# EAGLE schematic fbri_development (EAGLE 6.6.0)
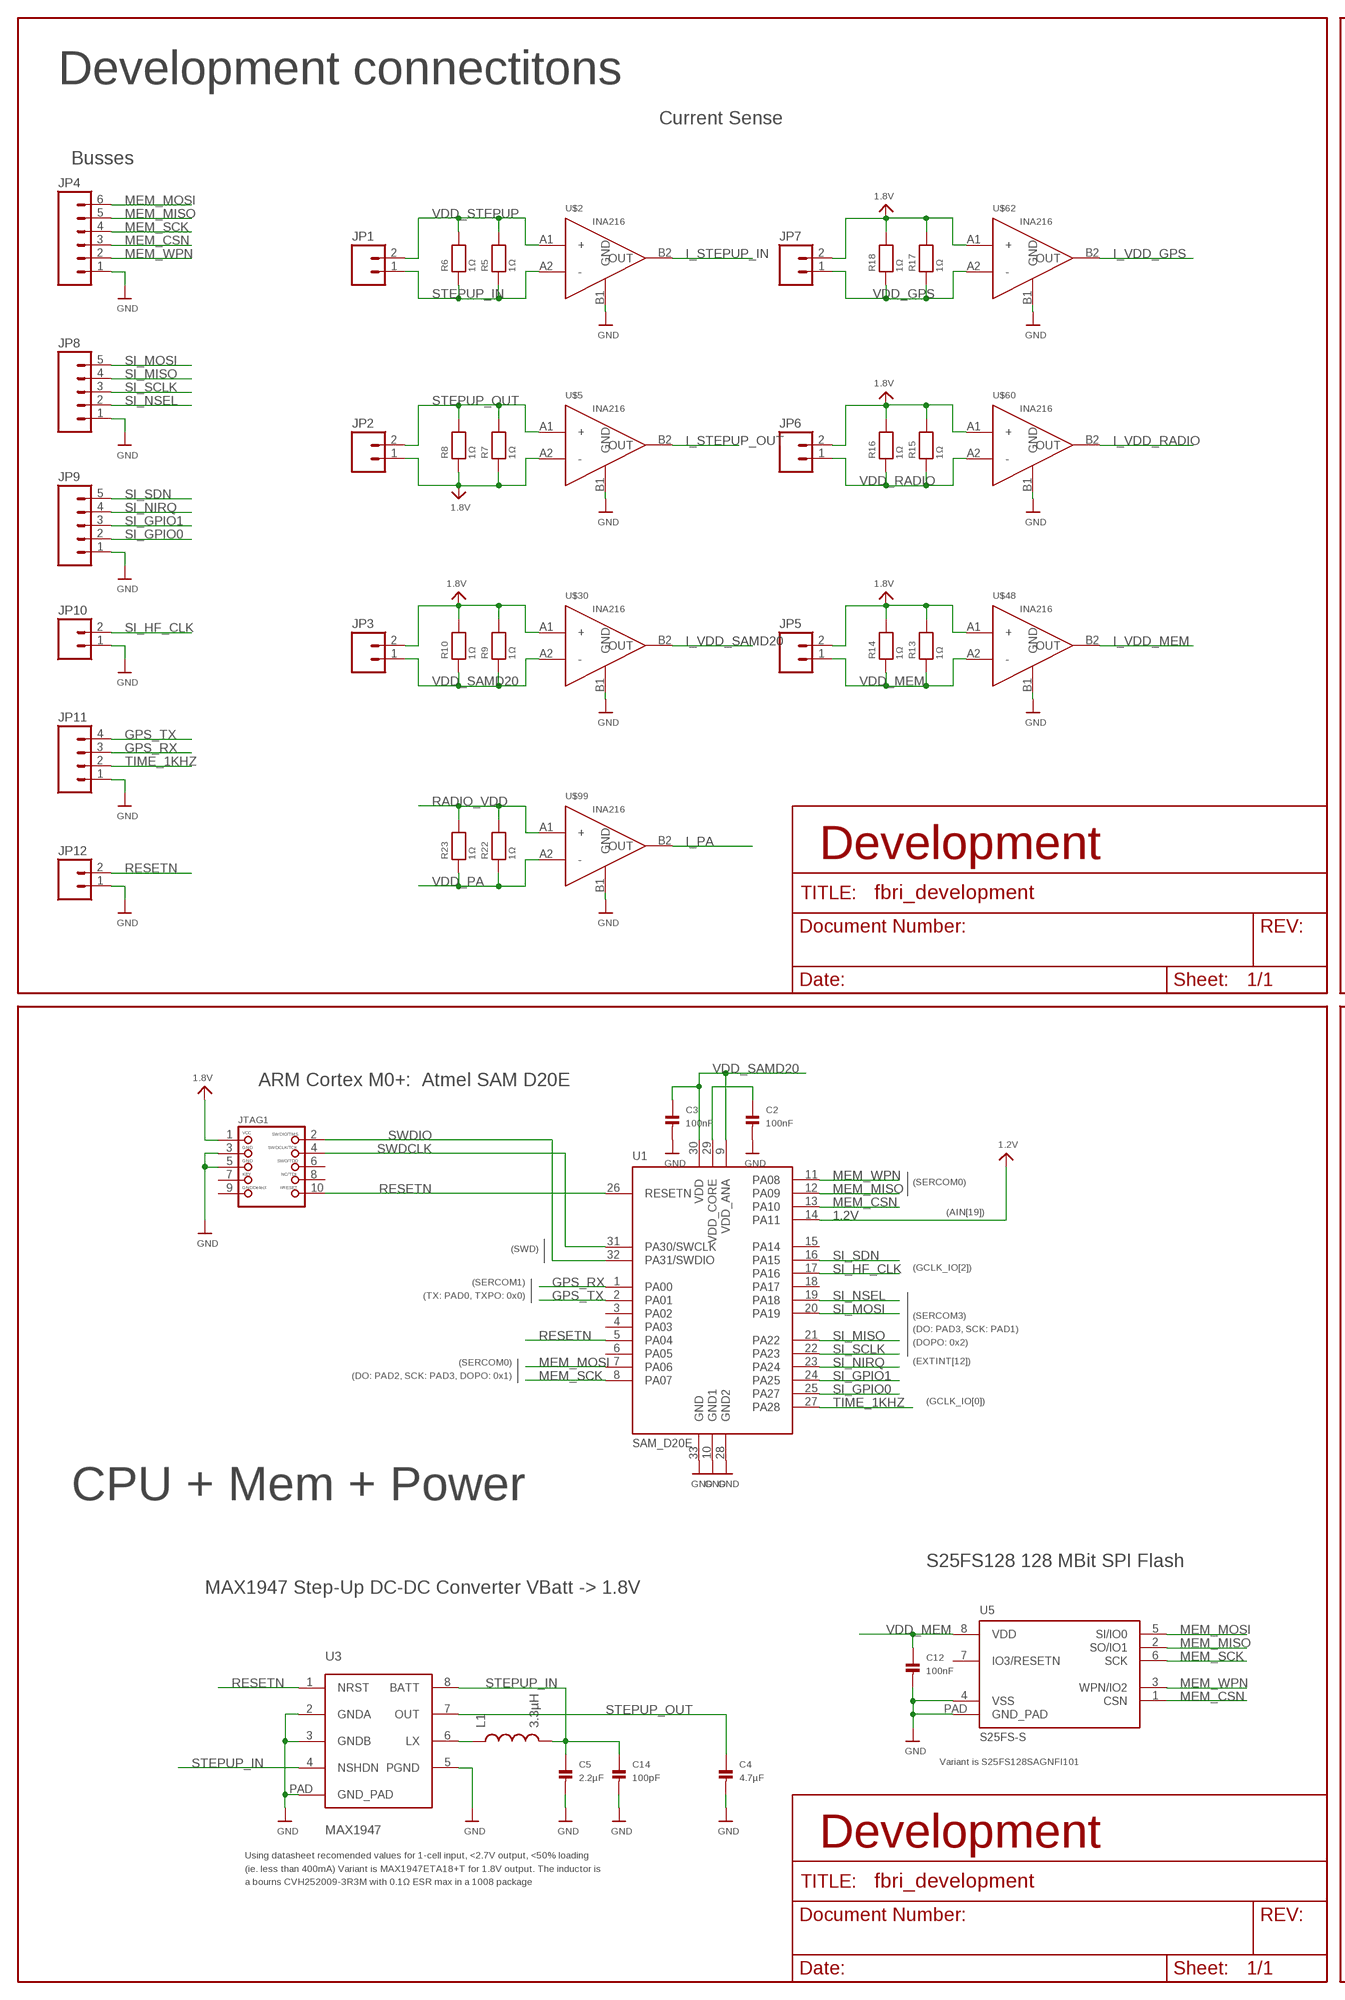
[diagram p0: schematic, sheet 1, part 1 of 2]
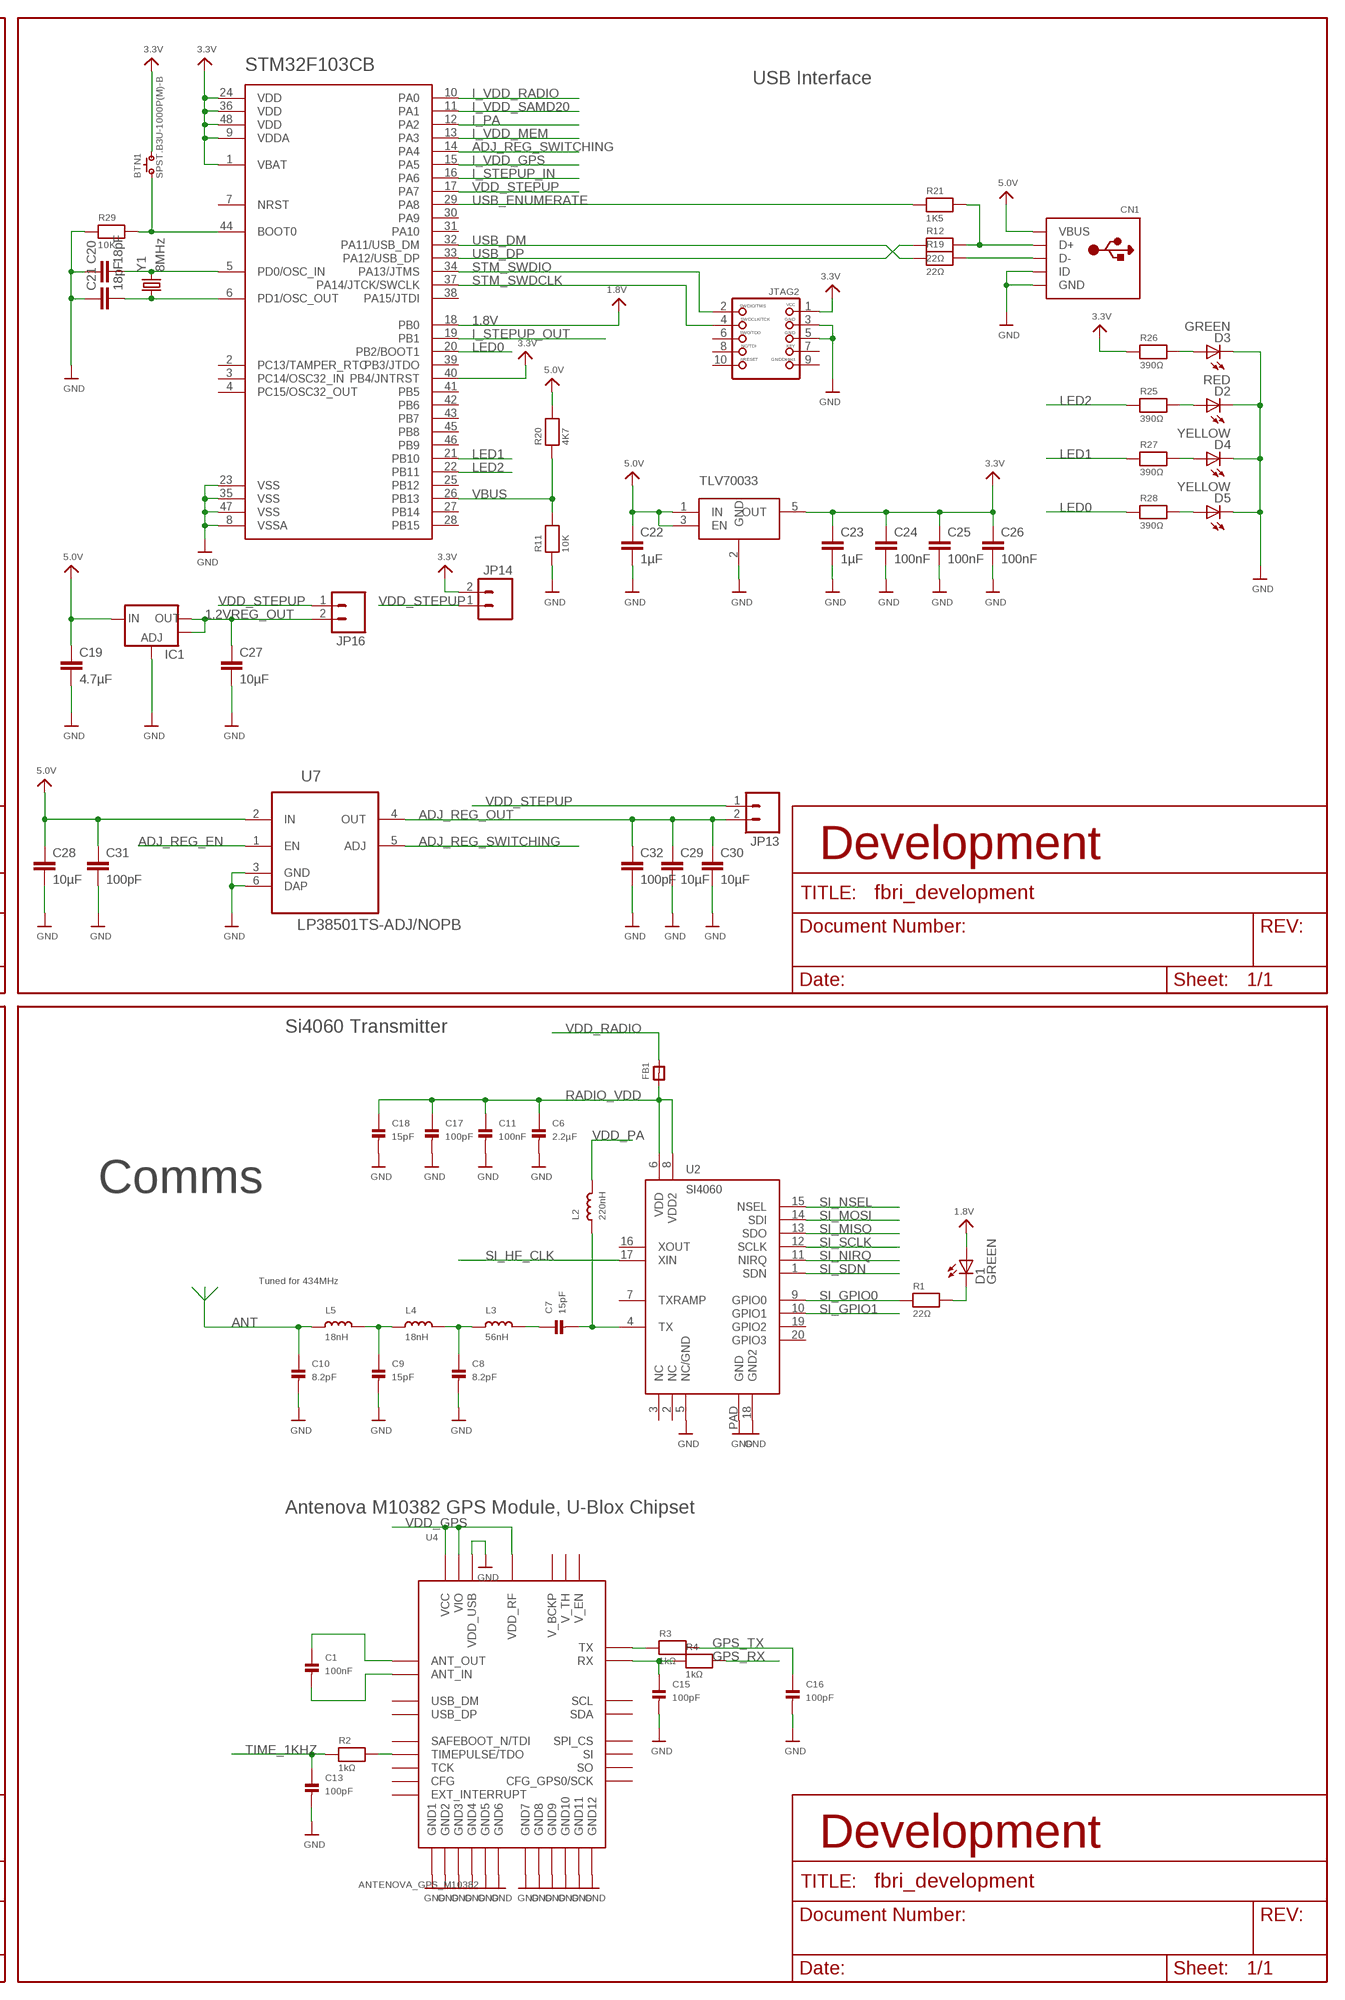
[diagram p1: schematic, sheet 1, part 2 of 2]

## Parts
BTN1  SPST.B3U-1000P(M)-B  [B3U-1000P(M)-B]
C1  100nF  CAP_CERAMIC_0402  [_0402]
C2  100nF  CAP_CERAMIC_0402  [_0402]
C3  100nF  CAP_CERAMIC_0402  [_0402]
C4  4.7µF  CAP_CERAMIC_0402  [_0402]
C5  2.2µF  CAP_CERAMIC_0402  [_0402]
C6  2.2µF  CAP_CERAMIC_0402  [_0402]
C7  15pF  CAP_CERAMIC_0402  [_0402]
C8  8.2pF  CAP_CERAMIC_0402  [_0402]
C9  15pF  CAP_CERAMIC_0402  [_0402]
C10  8.2pF  CAP_CERAMIC_0402  [_0402]
C11  100nF  CAP_CERAMIC_0402  [_0402]
C12  100nF  CAP_CERAMIC_0402  [_0402]
C13  100pF  CAP_CERAMIC_0402  [_0402]
C14  100pF  CAP_CERAMIC_0402  [_0402]
C15  100pF  CAP_CERAMIC_0402  [_0402]
C16  100pF  CAP_CERAMIC_0402  [_0402]
C17  100pF  CAP_CERAMIC_0402  [_0402]
C18  15pF  CAP_CERAMIC_0402  [_0402]
C19  4.7µF  C-EUC0603K  [C0603K]
C20  18pF  C-EUC0603K  [C0603K]
C21  18pF  C-EUC0603K  [C0603K]
C22  1µF  C-EUC0603K  [C0603K]
C23  1µF  C-EUC0603K  [C0603K]
C24  100nF  C-EUC0603K  [C0603K]
C25  100nF  C-EUC0603K  [C0603K]
C26  100nF  C-EUC0603K  [C0603K]
C27  10µF  C-EUC0603K  [C0603K]
C28  10µF  C-EUC0603K  [C0603K]
C29  10µF  C-EUC0603K  [C0603K]
C30  10µF  C-EUC0603K  [C0603K]
C31  100pF  C-EUC0603K  [C0603K]
C32  100pF  C-EUC0603K  [C0603K]
CN1  USBMINIB  [USB-MINIB]
D1  GREEN  LEDCHIPLED_0603  [CHIPLED_0603]
D2  RED  LEDCHIPLED_0603  [CHIPLED_0603]
D3  GREEN  LEDCHIPLED_0603  [CHIPLED_0603]
D4  YELLOW  LEDCHIPLED_0603  [CHIPLED_0603]
D5  YELLOW  LEDCHIPLED_0603  [CHIPLED_0603]
FB1  FERRITE_0402  [_0402]
IC1  V_REG_LM1117SOT223  [SOT223]
IC3  TLV70033DCK  TLV700DCK  [SC70-5L]
JP1  M02LOCK  [1X02_LOCK]
JP2  M02LOCK  [1X02_LOCK]
JP3  M02LOCK  [1X02_LOCK]
JP4  M06LOCK  [1X06_LOCK]
JP5  M02LOCK  [1X02_LOCK]
JP6  M02LOCK  [1X02_LOCK]
JP7  M02LOCK  [1X02_LOCK]
JP8  M05LOCK  [1X05_LOCK]
JP9  M05LOCK  [1X05_LOCK]
JP10  M02LOCK  [1X02_LOCK]
JP11  M04LOCK  [1X04_LOCK]
JP12  M02LOCK  [1X02_LOCK]
JP13  M02LOCK  [1X02_LOCK]
JP14  M02LOCK  [1X02_LOCK]
JP16  M02LOCK  [1X02_LOCK]
JTAG1  JTAG-CORTEXM3SMT  [2X05_1.27MM_SMT]
JTAG2  JTAG-CORTEXM3SMT  [2X05_1.27MM_SMT]
L1  3.3µH  INDUCTOR1007  [1007]
L2  220nH  INDUCTOR_0402  [_0402]
L3  56nH  INDUCTOR_0402  [_0402]
L4  18nH  INDUCTOR_0402  [_0402]
L5  18nH  INDUCTOR_0402  [_0402]
R1  22Ω  RESISTOR_0402  [_0402]
R2  1kΩ  RESISTOR_0402  [_0402]
R3  1kΩ  RESISTOR_0402  [_0402]
R4  1kΩ  RESISTOR_0402  [_0402]
R5  1Ω  RESISTOR_0402  [_0402]
R6  1Ω  RESISTOR_0402  [_0402]
R7  1Ω  RESISTOR_0402  [_0402]
R8  1Ω  RESISTOR_0402  [_0402]
R9  1Ω  RESISTOR_0402  [_0402]
R10  1Ω  RESISTOR_0402  [_0402]
R11  10K  RESISTOR0603MINI  [0603-MINI]
R12  22Ω  RESISTOR0603MINI  [0603-MINI]
R13  1Ω  RESISTOR_0402  [_0402]
R14  1Ω  RESISTOR_0402  [_0402]
R15  1Ω  RESISTOR_0402  [_0402]
R16  1Ω  RESISTOR_0402  [_0402]
R17  1Ω  RESISTOR_0402  [_0402]
R18  1Ω  RESISTOR_0402  [_0402]
R19  22Ω  RESISTOR0603MINI  [0603-MINI]
R20  4K7  RESISTOR0603MINI  [0603-MINI]
R21  1K5  RESISTOR0603MINI  [0603-MINI]
R22  1Ω  RESISTOR_0402  [_0402]
R23  1Ω  RESISTOR_0402  [_0402]
R25  390Ω  RESISTOR0603MINI  [0603-MINI]
R26  390Ω  RESISTOR0603MINI  [0603-MINI]
R27  390Ω  RESISTOR0603MINI  [0603-MINI]
R28  390Ω  RESISTOR0603MINI  [0603-MINI]
R29  10K  RESISTOR0603MINI  [0603-MINI]
U1  SAM_D20E  [QFN32_5MM]
U2  SI4060  [QFN20]
U3  MAX1947  [TDFN8]
U4  ANTENOVA_GPS_M10382  [ANTENOVA_GPS_M10382]
U5  S25FS-S  [WSON8]
U6  STM32F_48PIN  [TQFP48]
U7  LP38501TS-ADJ/NOPB  [TO170P1435X457-6N]
U$2  INA216  [WCSP-4]
U$5  INA216  [WCSP-4]
U$30  INA216  [WCSP-4]
U$48  INA216  [WCSP-4]
U$60  INA216  [WCSP-4]
U$62  INA216  [WCSP-4]
U$99  INA216  [WCSP-4]
Y1  8MHz  CRYSTAL5X3  [CRYSTAL-SMD-5X3]

## Nets
1.2V: U1.14(PA11)
1.2VREG_OUT: C27.1 IC1.2(OUT) IC1.4(OUT) JP16.2
1.8V: D1.A JP2.1 JP3.2 JP5.2 JP6.2 JP7.2 JTAG1.1 R7.1 R8.1 R9.2 R10.2 R13.2 R14.2 R15.2 R16.2 R17.2 R18.2 U6.18(PB0) U$5.A2(-) U$30.A1(+) U$48.A1(+) U$60.A1(+) U$62.A1(+)
3.3V: BTN1.2 C23.1 C24.1 C25.1 C26.1 IC3.5(OUT) JP14.2 JTAG2.1 R26.1 U6.1(VBAT) U6.9(VDDA) U6.24(VDD) U6.36(VDD) U6.40(PB4/JNTRST) U6.48(VDD)
5.0V: C19.1 C22.1 C28.1 C31.1 CN1.VBUS IC1.3(IN) IC3.1(IN) IC3.3(EN) R20.2 U7.2(IN)
ADJ_REG_EN: U7.1(EN)
ADJ_REG_OUT: C29.1 C30.1 C32.1 JP13.2 U7.4(OUT)
ADJ_REG_SWITCHING: U6.14(PA4) U7.5(ADJ)
AN_GPS_RX: C15.1 R4.1 U4.13_RX(RX)
AN_GPS_TX: R3.1 U4.11_TX(TX)
ANT: C10.1 L5.1
BOOT0: BTN1.1 R29.2 U6.44(BOOT0)
D+: CN1.D+ R12.2 R21.2
D-: CN1.D- R19.2
FILTER1: C8.1 L3.1 L4.2
FILTER2: C9.1 L4.1 L5.2
GND: C2.2 C3.2 C4.2 C5.2 C6.2 C8.2 C9.2 C10.2 C11.2 C12.2 C13.2 C14.2 C15.2 C16.2 C17.2 C18.2 C19.2 C20.1 C21.1 C22.2 C23.2 C24.2 C25.2 C26.2 C27.2 C28.2 C29.2 C30.2 C31.2 C32.2 CN1.GND CN1.ID D2.C D3.C D4.C D5.C IC1.1(ADJ) IC3.2(GND) JP4.1 JP8.1 JP9.1 JP10.1 JP11.1 JP12.1 JTAG1.3 JTAG1.5 JTAG2.3 JTAG2.5 R11.1 R29.1 U1.10(GND1) U1.28(GND2) U1.33(GND) U2.5(NC/GND) U2.18(GND2) U2.PAD(GND) U3.2(GNDA) U3.3(GNDB) U3.5(PGND) U3.PAD(GND_PAD) U4.2_GND(GND1) U4.4_GND(GND2) U4.14_GND(GND3) U4.17_GND(GND4) U4.21_GND(GND5) U4.24_GND(GND6) U4.26_GND(GND7) U4.28_GND(GND8) U4.32_VDD_USB(VDD_USB) U4.33_GND(GND9) U4.34_GND(GND10) U4.35_GND(GND11) U4.36_GND(GND12) U5.4(VSS) U5.PAD(GND_PAD) U6.8(VSSA) U6.23(VSS) U6.35(VSS) U6.47(VSS) U7.3(GND) U7.6(DAP) U$2.B1(GND) U$5.B1(GND) U$30.B1(GND) U$48.B1(GND) U$60.B1(GND) U$62.B1(GND) U$99.B1(GND)
GPS_ANT_IN: C1.2 U4.1_ANT_IN(ANT_IN)
GPS_ANT_OUT: C1.1 U4.3_ANT_OUT(ANT_OUT)
GPS_RX: JP11.3 R4.2 U1.1(PA00)
GPS_TX: C16.1 JP11.4 R3.2 U1.2(PA01)
I_PA: U6.12(PA2) U$99.B2(OUT)
I_STEPUP_IN: U6.16(PA6) U$2.B2(OUT)
I_STEPUP_OUT: U6.19(PB1) U$5.B2(OUT)
I_VDD_GPS: U6.15(PA5) U$62.B2(OUT)
I_VDD_MEM: U6.13(PA3) U$48.B2(OUT)
I_VDD_RADIO: U6.10(PA0) U$60.B2(OUT)
I_VDD_SAMD20: U6.11(PA1) U$30.B2(OUT)
LED0: R28.1 U6.20(PB2/BOOT1)
LED1: R27.1 U6.21(PB10)
LED2: R25.1 U6.22(PB11)
LED_RES: D1.C R1.2
LPC_XTAL2: C21.2 U6.6(PD1/OSC_OUT) Y1.1
LX: L1.1 U3.6(LX)
MEM_CSN: JP4.3 U1.13(PA10) U5.1(CSN)
MEM_MISO: JP4.5 U1.12(PA09) U5.2(SO/IO1)
MEM_MOSI: JP4.6 U1.7(PA06) U5.5(SI/IO0)
MEM_SCK: JP4.4 U1.8(PA07) U5.6(SCK)
MEM_WPN: JP4.2 U1.11(PA08) U5.3(WPN/IO2)
N$2: D2.A R25.2
N$4: D3.A R26.2
N$6: D4.A R27.2
N$8: D5.A R28.2
OSC_IN: C20.2 U6.5(PD0/OSC_IN) Y1.3
RADIO_VDD: C6.1 C11.1 C17.1 C18.1 FB1.1 R22.2 R23.2 U2.6(VDD) U2.8(VDD2) U$99.A1(+)
RESETN: JP12.2 JTAG1.10 U1.5(PA04) U1.26(RESETN) U3.1(NRST)
RF_OUT: C7.2 L2.1 U2.4(TX)
SI_GPIO0: JP9.2 R1.1 U1.25(PA27) U2.9(GPIO0)
SI_GPIO1: JP9.3 U1.24(PA25) U2.10(GPIO1)
SI_HF_CLK: JP10.2 U1.17(PA16) U2.17(XIN)
SI_MISO: JP8.4 U1.21(PA22) U2.13(SDO)
SI_MOSI: JP8.5 U1.20(PA19) U2.14(SDI)
SI_NIRQ: JP9.4 U1.23(PA24) U2.11(NIRQ)
SI_NSEL: JP8.2 U1.19(PA18) U2.15(NSEL)
SI_SCLK: JP8.3 U1.22(PA23) U2.12(SCLK)
SI_SDN: JP9.5 U1.16(PA15) U2.1(SDN)
STEPUP_IN: C5.1 C14.1 JP1.1 L1.2 R5.1 R6.1 U3.4(NSHDN) U3.8(BATT) U$2.A2(-)
STEPUP_OUT: C4.1 JP2.2 R7.2 R8.2 U3.7(OUT) U$5.A1(+)
STM_SWDCLK: JTAG2.4 U6.37(PA14/JTCK/SWCLK)
STM_SWDIO: JTAG2.2 U6.34(PA13/JTMS)
SWDCLK: JTAG1.4 U1.31(PA30/SWCLK)
SWDIO: JTAG1.2 U1.32(PA31/SWDIO)
TANK: C7.1 L3.2
TIME_1KHZ: C13.1 JP11.2 R2.1 U1.27(PA28)
TIME_1KHZ_DRIVE: R2.2 U4.23_TIMEPULSE/TDO(TIMEPULSE/TDO)
USB_DM: R19.1 U6.32(PA11/USB_DM)
USB_DP: R12.1 U6.33(PA12/USB_DP)
USB_ENUMERATE: R21.1 U6.29(PA8)
VBUS: R11.2 R20.1 U6.26(PB13)
VDD_CORE: C2.1 U1.29(VDD_CORE)
VDD_GPS: JP7.1 R17.1 R18.1 U4.5_VIO(VIO) U4.25_VDD_RF(VDD_RF) U4.27_VCC(VCC) U$62.A2(-)
VDD_MEM: C12.1 JP5.1 R13.1 R14.1 U5.8(VDD) U$48.A2(-)
VDD_PA: L2.2 R22.1 R23.1 U$99.A2(-)
VDD_RADIO: FB1.2 JP6.1 R15.1 R16.1 U$60.A2(-)
VDD_SAMD20: C3.1 JP3.1 R9.1 R10.1 U1.9(VDD_ANA) U1.30(VDD) U$30.A2(-)
VDD_STEPUP: JP1.2 JP13.1 JP14.1 JP16.1 R5.2 R6.2 U6.17(PA7) U$2.A1(+)
Unconnected: JTAG1.6 JTAG1.7 JTAG1.8 JTAG1.9 JTAG2.6 JTAG2.7 JTAG2.8 JTAG2.9 JTAG2.10 U1.3(PA02) U1.4(PA03) U1.6(PA05) U1.15(PA14) U1.18(PA17) U2.2(NC) U2.3(NC ) U2.7(TXRAMP) U2.16(XOUT) U2.19(GPIO2) U2.20(GPIO3) U4.6_USB_DP(USB_DP) U4.7_USB_DM(USB_DM) U4.8_SO(SO) U4.9_CFG_GPS0_SCK(CFG_GPS0/SCK) U4.10_SPI_SELECT(SPI_CS) U4.12_V_TH(V_TH) U4.15_V_BCKUP(V_BCKP) U4.16_SI(SI) U4.18_SDA(SDA) U4.19_SCL(SCL) U4.20_SAFEBOOT_N/TDI(SAFEBOOT_N/TDI) U4.22_TCK(TCK) U4.29_EXT_INTERRUPT(EXT_INTERRUPT) U4.30_V_EN(V_EN) U4.31_CFG(CFG) U5.7(IO3/RESETN) U6.2(PC13/TAMPER_RTC) U6.3(PC14/OSC32_IN) U6.4(PC15/OSC32_OUT) U6.7(NRST) U6.25(PB12) U6.27(PB14) U6.28(PB15) U6.30(PA9) U6.31(PA10) U6.38(PA15/JTDI) U6.39(PB3/JTDO) U6.41(PB5) U6.42(PB6) U6.43(PB7) U6.45(PB8) U6.46(PB9)

## Notes on the sheet
- STM32F103CB
- Development connectitons | USB Interface
- Current Sense
- Busses
- TLV70033
- Development | Development
- Si4060 Transmitter
- ARM Cortex M0+:  Atmel SAM D20E
- (SERCOM0)
- Comms
- (AIN[19])
- (SWD)
- (GCLK_IO[2])
- (SERCOM1) | Tuned for 434MHz
- (TX: PAD0, TXPO: 0x0)
- (SERCOM3)
- (DO: PAD3, SCK: PAD1)
- (DOPO: 0x2)
- (SERCOM0) | (EXTINT[12])
- (DO: PAD2, SCK: PAD3, DOPO: 0x1)
- (GCLK_IO[0])
- CPU + Mem + Power
- Antenova M10382 GPS Module, U-Blox Chipset
- S25FS128 128 MBit SPI Flash
- MAX1947 Step-Up DC-DC Converter VBatt -> 1.8V
- Variant is S25FS128SAGNFI101
- Development | Development
- Using datasheet recomended values for 1-cell input, <2.7V output, <50% loading 
  (ie. less than 400mA) Variant is MAX1947ETA18+T for 1.8V output. The inductor is 
  a bourns CVH252009-3R3M with 0.1Ω ESR max in a 1008 package

## Library data of the parts
BTN1 = omron:SPST
C1-C18 = microbuilder_v3:CAP_CERAMIC: Ceramic Capacitors 0402 - 0402 Surface Mount Capacitors 16pF 50V 5% [Digikey: 445-4899-2-ND] 18pF 50V 5% [Digikey: 490-1281-2-ND] 22pF 50V 5% [Digikey: 490-1283-2-ND] 68pF 50V 5% [Digikey: 490-1289-2-ND] 0.1uF 10V 10% [Digikey: 490-1318-2-ND] 1.0uF 6.3V 10% [Digikey: 490-1320-2-ND] 0603 - 0603 Surface Mount Capacitors 16 pF 50V 5% [Digikey: 445-5051-2-ND] 22 pF 50V [Digikey: PCC220ACVTR-ND] 33 pF 50V 5% [Digikey: 490-1415-1-ND] 56pF 50V 5% [Digikey: 490-1421-1-ND] 220pF 50V 5% [Digikey: 445-1285-1-ND] 680 pF 50V 2200 pF 50V 5% C0G [Digikey: 445-1297-1-ND] 5600 pF 100V 5% X7R [Digikey: 478-3711-1-ND] 0.1 µF 25V 10% [Digikey: PCC2277TR-ND] 0.22 µF 16V 10% X7R [Digikey: 445-1318-1-ND] 1.0 µF 25V 10% [Digikey: 445-5146-2-ND] 0603 - RF Specific 3pF 250V +/-0.1pF RF [Digikey: 712-1347-1-ND] 18 pF 250V 5% [Digikey: 478-3505-1-ND or 712-1322-1-ND] 56 pF 250V 5% C0G RF [Digikey: 490-4867-1-ND] 68 pF 250V RF [Digikey: 490-4868-1-ND] 0805 - 0805 Surface Mount Capacitors 220 pF 250V 2% RF Ceramic Capacitor [Digikey: 712-1398-1-ND] 1000 pF 50V 2% NP0 Ceramic Capacitor [Digikey: 478-3760-1-ND] 0.1 µF 25V 10% Ceramic Capacitor [Digikey: PCC1828TR-ND] 1.0 µF 16V 10% Ceramic Capacitor[Digikey: 490-1691-2-ND] 10.0 µF 10V 10% Ceramic Capacitor[Digikey: 709-1228-1-ND] 10.0 uF 16V 10% Ceramic Capacitor [Digikey: 478-5165-2-ND] 47 uF 6.3V 20% Ceramic Capacitor [Digikey: 587-1779-1-ND or 399-5506-1-ND] 1206 - 1206 Surface Mount Capacitors 47uF 10V 20% Ceramic Capacitor [Digikey: 490-5528-1-ND or 399-5508-1-ND or 445-6010-1-ND] 100uF 6.3V -20%, +80% Y5V Ceramic Capacitor (Digikey: 490-4512-1-ND, Mouser: 81-GRM31CF50J107ZE1L)
C19-C32 = resistor:C-EU: CAPACITOR, European symbol
CN1 = microbuilder_v3:USB: USB Connectors USBMINIB - Surface Mount Female Mini-B USB Connector 4UConnector: 06564
D1-D5 = led:LED: LED OSRAM: - CHIPLED LG R971, LG N971, LY N971, LG Q971, LY Q971, LO R971, LY R971 LH N974, LH R974 LS Q976, LO Q976, LY Q976 LO Q996 - Hyper CHIPLED LW Q18S LB Q993, LB Q99A, LB R99A - SideLED LS A670, LO A670, LY A670, LG A670, LP A670 LB A673, LV A673, LT A673, LW A673 LH A674 LY A675 LS A676, LA A676, LO A676, LY A676, LW A676 LS A679, LY A679, LG A679 - Hyper Micro SIDELED® LS Y876, LA Y876, LO Y876, LY Y876 LT Y87S - SmartLED LW L88C, LW L88S LB L89C, LB L89S, LG L890 LS L89K, LO L89K, LY L89K LS L896, LA L896, LO L896, LY L896 - TOPLED LS T670, LO T670, LY T670, LG T670, LP T670 LSG T670, LSP T670, LSY T670, LOP T670, LYG T670 LG T671, LOG T671, LSG T671 LB T673, LV T673, LT T673, LW T673 LH T674 LS T676, LA T676, LO T676, LY T676, LB T676, LH T676, LSB T676, LW T676 LB T67C, LV T67C, LT T67C, LS T67K, LO T67K, LY T67K, LW E67C LS E67B, LA E67B, LO E67B, LY E67B, LB E67C, LV E67C, LT E67C LW T67C LS T679, LY T679, LG T679 LS T770, LO T770, LY T770, LG T770, LP T770 LB T773, LV T773, LT T773, LW T773 LH T774 LS E675, LA E675, LY E675, LS T675 LS T776, LA T776, LO T776, LY T776, LB T776 LHGB T686 LT T68C, LB T68C - Hyper Mini TOPLED® LB M676 - Mini TOPLED Santana® LG M470 LS M47K, LO M47K, LY M47K Source: http://www.osram.convergy.de LUXEON: - LUMILED® LXK2-PW12-R00, LXK2-PW12-S00, LXK2-PW14-U00, LXK2-PW14-V00 LXK2-PM12-R00, LXK2-PM12-S00, LXK2-PM14-U00 LXK2-PE12-Q00, LXK2-PE12-R00, LXK2-PE12-S00, LXK2-PE14-T00, LXK2-PE14-U00 LXK2-PB12-K00, LXK2-PB12-L00, LXK2-PB12-M00, LXK2-PB14-N00, LXK2-PB14-P00, LXK2-PB14-Q00 LXK2-PR12-L00, LXK2-PR12-M00, LXK2-PR14-Q00, LXK2-PR14-R00 LXK2-PD12-Q00, LXK2-PD12-R00, LXK2-PD12-S00 LXK2-PH12-R00, LXK2-PH12-S00 LXK2-PL12-P00, LXK2-PL12-Q00, LXK2-PL12-R00 Source: www.luxeon.com KINGBRIGHT: KA-3528ASYC Source: www.kingbright.com
FB1 = microbuilder_v3:FERRITE: Ferrite Bead 0603 MMZ1608B121C - 120 Ohm @ 100MHz, 600mA, 0.15 Ohm DC Resistance - Digikey: 445-2164-1-ND BK1608HW121-T - 120 Ohm, 600mA Ferrite Chip - Digikey: 587-1876-2-ND 0805 HZ0805B272R-10 - 2.7K Ohm @ 100MHz, 200mA, 0.8 Ohm DC Resistance - Digikey: 240-2504-1-ND (see also Murata BLM21BD272SN1L) MMZ2012Y152B - 1.5K Ohm @ 100MHz, 500mA, 0.4 Ohm DC Resistance - Digikey: 445-1560-1-ND - Mainly for high frequency (80-400MHz) MMZ2012R102A - 1K Ohm @ 100MHz, 500mA, 0.3 Ohm DC Resistance - Digikey: 445-1555-2-ND - More general purpose (10-200MHz)
IC1 = SparkFun:V_REG_LM1117: Voltage Regulator LM1117 Standard adjustable voltage regulator but in SMD form. Spark Fun Electronics SKU : COM-00595
IC3 = tlv700:TLV700
JP1-JP3 JP5-JP7 JP10 JP12-JP14 JP16 = SparkFun:M02: Header 2 Standard 2-pin 0.1" header. Use with straight break away headers (SKU : PRT-00116), right angle break away headers (PRT-00553), swiss pins (PRT-00743), machine pins (PRT-00117), and female headers (PRT-00115). Molex polarized connector foot print use with SKU : PRT-08233 with associated crimp pins and housings.
JP4 = SparkFun:M06: Header 6 Standard 6-pin 0.1" header. Use with straight break away headers (SKU : PRT-00116), right angle break away headers (PRT-00553), swiss pins (PRT-00743), machine pins (PRT-00117), and female headers (PRT-00115). Molex polarized connector foot print use with SKU : PRT-08094 with associated crimp pins and housings. NOTES ON THE VARIANTS LOCK and LOCK_LONGPADS... This footprint was designed to help hold the alignment of a through-hole component (i.e. 6-pin header) while soldering it into place. You may notice that each hole has been shifted either up or down by 0.005 of an inch from it's more standard position (which is a perfectly straight line). This slight alteration caused the pins (the squares in the middle) to touch the edges of the holes. Because they are alternating, it causes a "brace" to hold the component in place. 0.005 has proven to be the perfect amount of "off-center" position when using our standard breakaway headers. Although looks a little odd when you look at the bare footprint, once you have a header in there, the alteration is very hard to notice. Also, if you push a header all the way into place, it is covered up entirely on the bottom side. This idea of altering the position of holes to aid alignment will be further integrated into the Sparkfun Library for other footprints. It can help hold any component with 3 or more connection pins.
JP8 JP9 = SparkFun:M05: Header 5 Standard 5-pin 0.1" header. Use with straight break away headers (SKU : PRT-00116), right angle break away headers (PRT-00553), swiss pins (PRT-00743), machine pins (PRT-00117), and female headers (PRT-00115). Molex polarized connector foot print use with SKU : PRT-08230 with associated crimp pins and housings.
JP11 = SparkFun:M04: Header 4 Standard 4-pin 0.1" header. Use with straight break away headers (SKU : PRT-00116), right angle break away headers (PRT-00553), swiss pins (PRT-00743), machine pins (PRT-00117), and female headers (PRT-00115). Molex polarized connector foot print use with SKU : PRT-08231 with associated crimp pins and housings. 1MM SMD Version SKU: PRT-10208
JTAG1 JTAG2 = microbuilder_v3:JTAG-CORTEXM3: Serial Wire (SW-DP) Connector This standard 0.05" 10-pin connector is for use with the Cortex M0/M3's native SWD (serial wire debugger) interface (SW-DP). Some boards support a 20-pin combined JTAG+SWD connector (SWJ-DP), such as the LPC1700 family, but many smaller devices only work with SWD which typically use the smaller 10-pin SW-DP connecter (the LPC1300 family, for example, only supports SWD). 2x05 1.27mm/0.05" Connector: This is the standard SMT connector defined by ARM for all Cortex devices, and should be used in most situations and for forward-compatibility since any new devices coming to market will likely use this connector. MOLEX 10 Pin 0.1" Connector: This 0.1" 10 pin connector has the same pin layout as the standard 0.05" connector, but is easier to work with if you are using standard jumper wires or custom cables to connect your SWD hardware. MOLEX 20 Pin 0.1" Connector: This 0.1" 20 pin connector is the same model used for ARM7/ARM9 JTAG debuggers, but is connected to match the pins on the Segger J-Link for ARM (which supports both JTAG and SWD debugging). See the following document from ARM for more information on Cortex M3 Debug Connectors: http://infocenter.arm.com/help/topic/com.arm.doc.faqs/attached/13634/cortex_debug_connectors.pdf And the following page for an overview with images of the different connector types: http://www.keil.com/peripherals/coresight/connectors.asp
L1 = SparkFun:INDUCTOR: Inductors
L2-L5 = microbuilder_v3:INDUCTOR: Inductors
R1-R10 R13-R18 R22 R23 = microbuilder_v3:RESISTOR: Resistors 0402 - 0402 Surface Mount Package 22 Ohm 1% 1/16W [Digikey: 311-22.0LRTR-ND] 33 Ohm 5% 1/16W 1.0K 5% 1/16W 1.5K 5% 1/16W 2.0K 1% 1/16W 10.0K 1% 1/16W [Digikey: 311-10.0KLRTR-ND] 10.0K 5% 1/16W [Digikey: RMCF0402JT10K0TR-ND] 12.1K 1% 1/16W [Digikey: 311-22.0LRTR-ND] 100.0K 5% 1/16W 0603 - 0603 Surface Mount Package 0 Ohm 1/10 Watt 1% Resistor 15 Ohm 1/10 Watt 1% Resistor 33 Ohm 1/10 Watt 1% Resistor 49.9 Ohm 1/10 Watt 1% Resistor 100 Ohm 1/10 Watt 1% Resistor 150 Ohm 1/10 Watt 1% Resistor 240 Ohm 1/10 Watt 1% Resistor 390 Ohm 1/10 Watt 1% Resistor 560 Ohm 1/10 Watt 1% Resistor 680 Ohm 1/10 Watt 1% Resistor 750 Ohm 1/10 Watt 1% Resistor 1.0K Ohm 1/10 Watt 1% Resistor 1.5K Ohm 1/10 Watt 1% Resistor 2.0K Ohm 1/10 Watt 1% Resistor 2.2K Ohm 1/10 Watt 1% Resistor 3.3K Ohm 1/10 Watt 1% Resistor 4.7K Ohm 1/10 Watt 1% Resistor 10.0K Ohm 1/10 Watt 1% Resistor 12.0K Ohm 1/10 Watt 1% Resistor 12.1K Ohm 1/10 Watt 1% Resistor 20.0K Ohm 1/10 Watt 1% Resistor 33.0K Ohm 1/10 Watt 1% Resistor 100.0K Ohm 1/10 Watt 1% Resistor 0805 - 0805 Surface Mount Package 0 Ohm 1/8 Watt 1% Resistor 33 Ohm 1/8 Watt 1% Resistor 100 Ohm 1/8 Watt 1% Resistor 150 Ohm 1/8 Watt 1% Resistor 200 Ohm 1/8 Watt 1% Resistor 240 Ohm 1/8 Watt 1% Resistor 330 Ohm 1/8 Watt 1% Resistor 390 Ohm 1/8 Watt 1% Resistor 470 Ohm 1/8 Watt 1% Resistor 1.0K Ohm 1/8 Watt 1% Resistor 1.5K Ohm 1/8 Watt 1% Resistor 2.0K Ohm 1/8 Watt 1% Resistor 4.7K Ohm 1/8 Watt 1% Resistor 5.1K Ohm 1/8 Watt 1% Resistor 5.6K Ohm 1/8 Watt 1% Resistor 10.0K Ohm 1/8 Watt 1% Resistor 22.0K Ohm 1/8 Watt 1% Resistor 33.0K Ohm 1/8 Watt 1% Resistor 100K Ohm 1/8 Watt 1% Resistor 1206 - 1206 Surface Mount Package 2012 - 2010 Surface Mount Package 0.11 Ohm 1/2 Watt 1% Resistor - Digikey: RHM.11UCT-ND
R11 R12 R19-R21 R25-R29 = microbuilder:RESISTOR: Resistors 0402 - 0402 Surface Mount Package 22 Ohm 1% 1/16W [Digikey: 311-22.0LRTR-ND] 33 Ohm 5% 1/16W 1.0K 5% 1/16W 1.5K 5% 1/16W 2.0K 1% 1/16W 10.0K 1% 1/16W [Digikey: 311-10.0KLRTR-ND] 10.0K 5% 1/16W [Digikey: RMCF0402JT10K0TR-ND] 12.1K 1% 1/16W [Digikey: 311-22.0LRTR-ND] 100.0K 5% 1/16W 0603 - 0603 Surface Mount Package 0 Ohm 1/10 Watt 1% Resistor 15 Ohm 1/10 Watt 1% Resistor 33 Ohm 1/10 Watt 1% Resistor 49.9 Ohm 1/10 Watt 1% Resistor 100 Ohm 1/10 Watt 1% Resistor 150 Ohm 1/10 Watt 1% Resistor 240 Ohm 1/10 Watt 1% Resistor 390 Ohm 1/10 Watt 1% Resistor 560 Ohm 1/10 Watt 1% Resistor 680 Ohm 1/10 Watt 1% Resistor 750 Ohm 1/10 Watt 1% Resistor 1.0K Ohm 1/10 Watt 1% Resistor 1.5K Ohm 1/10 Watt 1% Resistor 2.0K Ohm 1/10 Watt 1% Resistor 2.2K Ohm 1/10 Watt 1% Resistor 3.3K Ohm 1/10 Watt 1% Resistor 4.7K Ohm 1/10 Watt 1% Resistor 10.0K Ohm 1/10 Watt 1% Resistor 12.0K Ohm 1/10 Watt 1% Resistor 12.1K Ohm 1/10 Watt 1% Resistor 20.0K Ohm 1/10 Watt 1% Resistor 33.0K Ohm 1/10 Watt 1% Resistor 100.0K Ohm 1/10 Watt 1% Resistor 0805 - 0805 Surface Mount Package 0 Ohm 1/8 Watt 1% Resistor 33 Ohm 1/8 Watt 1% Resistor 100 Ohm 1/8 Watt 1% Resistor 150 Ohm 1/8 Watt 1% Resistor 200 Ohm 1/8 Watt 1% Resistor 240 Ohm 1/8 Watt 1% Resistor 330 Ohm 1/8 Watt 1% Resistor 390 Ohm 1/8 Watt 1% Resistor 470 Ohm 1/8 Watt 1% Resistor 1.0K Ohm 1/8 Watt 1% Resistor 1.5K Ohm 1/8 Watt 1% Resistor 2.0K Ohm 1/8 Watt 1% Resistor 4.7K Ohm 1/8 Watt 1% Resistor 5.1K Ohm 1/8 Watt 1% Resistor 5.6K Ohm 1/8 Watt 1% Resistor 10.0K Ohm 1/8 Watt 1% Resistor 22.0K Ohm 1/8 Watt 1% Resistor 33.0K Ohm 1/8 Watt 1% Resistor 100K Ohm 1/8 Watt 1% Resistor 1206 - 1206 Surface Mount Package 2012 - 2010 Surface Mount Package 0.11 Ohm 1/2 Watt 1% Resistor - Digikey: RHM.11UCT-ND
U1 = fbri:SAM_D20E
U2 = fbri:SI4060
U3 = fbri:MAX1947
U4 = fbri:ANTENOVA_GPS_M10382
U5 = fbri:S25FS-S
U6 = stm32f:STM32F_48PIN
U7 = LP38501TS-ADJ:LP38501TS-ADJ/NOPB: IC, 3A FlexCap Low Dropout Linear Regulator for 2.7V to 5.5V Inputs,TO263-5; MPN: LP38501TS-ADJ/NOPB; OC_FARNELL: 2102669; OC_NEWARK: 64M7063; PACKAGE: TO263-5; SUPPLIER: TEXAS INSTRUMENTS
U$2 U$5 U$30 U$48 U$60 U$62 U$99 = fbri:INA216
Y1 = SparkFun:CRYSTAL: Crystals Various standard crystals. Proven footprints. Spark Fun Electronics SKU : COM-00534